# EAGLE design RS232 (EAGLE 4.16)
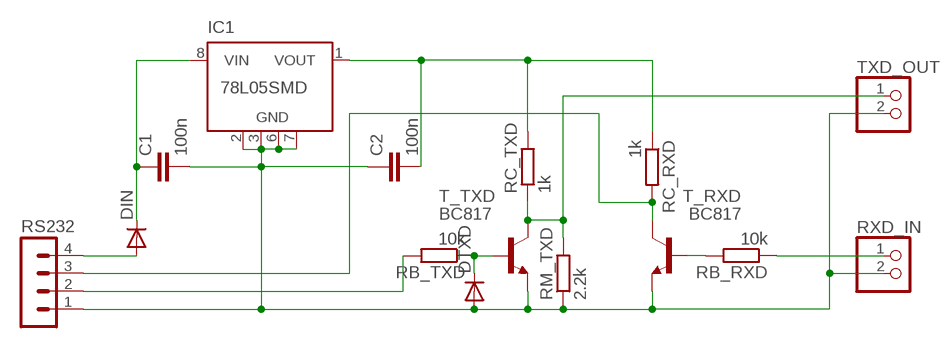
[diagram p0: schematic, sheet 1]

## Parts
C1  100n  C-EUC1206  [C1206]
C2  100n  C-EUC1206  [C1206]
DIN  DIODE-SMB  [SMB]
DTXD  DIODE-SMB  [SMB]
IC1  78L05SMD  [SO08]
RB_RXD  10k  R-EU_R1206  [R1206]
RB_TXD  10k  R-EU_R1206  [R1206]
RC_RXD  1k  R-EU_R1206  [R1206]
RC_TXD  1k  R-EU_R1206  [R1206]
RM_TXD  2.2k  R-EU_R1206  [R1206]
RS232  MA04-1  [MA04-1]
RXD_IN  PINHD-1X2  [1X02]
T_RXD  BC817  BC817-16SMD  [SOT23-BEC]
T_TXD  BC817  BC817-16SMD  [SOT23-BEC]
TXD_OUT  PINHD-1X2  [1X02]

## Nets
N$1: C1.1 DIN.C IC1.8(VIN)
N$2: C1.2 C2.1 DTXD.A IC1.2(GND) IC1.3(GND) IC1.6(GND) IC1.7(GND) RM_TXD.1 RS232.1 RXD_IN.2 T_RXD.E T_TXD.E TXD_OUT.2
N$3: DTXD.C RB_TXD.1 T_TXD.B
N$4: RB_RXD.2 T_RXD.B
N$5: RC_TXD.1 RM_TXD.2 T_TXD.C TXD_OUT.1
N$6: C2.2 IC1.1(VOUT) RC_RXD.1 RC_TXD.2
N$7: RB_RXD.1 RXD_IN.1
N$8: DIN.A RS232.4
N$9: RC_RXD.2 RS232.3 T_RXD.C
N$10: RB_TXD.2 RS232.2
Unconnected: IC1.4(NC) IC1.5(NC)

## Library data of the parts
C1 C2 = rcl:C-EU: CAPACITOR, European symbol
DIN DTXD = diode:DIODE-: DIODE
IC1 = linear:78L*SMD: Positive VOLTAGE REGULATOR
RB_RXD RB_TXD RC_RXD RC_TXD RM_TXD = rcl:R-EU_: RESISTOR, European symbol
RS232 = con-lstb:MA04-1: PIN HEADER
RXD_IN TXD_OUT = pinhead:PINHD-1X2: PIN HEADER
T_RXD T_TXD = transistor-npn:BC817*: NPN Transistor

## Board
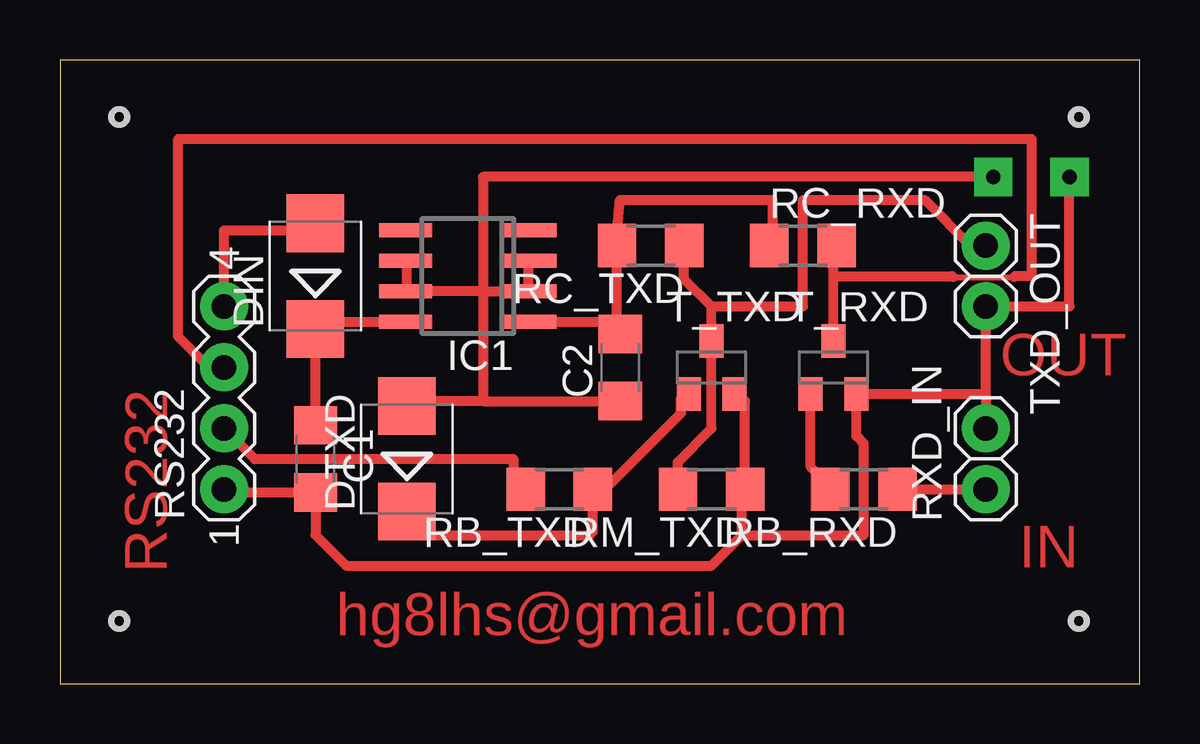
[diagram p1: board, top side]
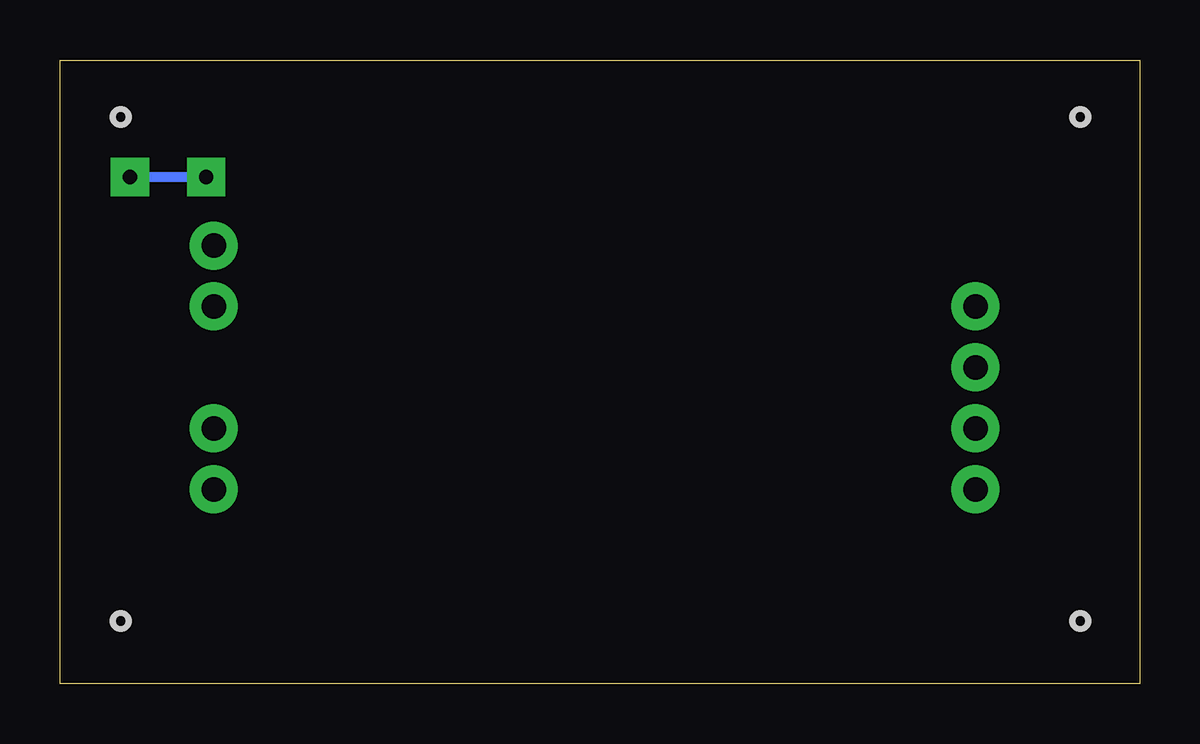
[diagram p2: board, bottom side, seen from below]

Size 45 x 26 mm. Coordinates in mm from the lower left corner, seen from the top.
Outline: 0,0 45,0 45,26 0,26 0,0
Copper layers (1*16): Top 0.0356mm / dielectric 1.5011mm / Bottom 0.0356mm
Design rules "default": minimum track width 0.1mm, minimum drill 1mil, track to track 0.25mm, track to pad 0.25mm, pad to pad 0.25mm, via to via 0.25mm, smd to smd 0.25mm, copper to edge 2.5mm, drill to drill 80mil, minimum pad ring 0.5mm, minimum via ring 0.5mm, stop-mask expansion 4mil, vias tented up to drill 0mil, thermal gap 10mil
Holes 0.5 mm at 2.47,23.63 2.47,2.63 42.47,2.63 42.47,23.63
Holes 0.6 mm at 2.47,23.63 2.47,2.63 42.47,2.63 42.47,23.63
Holes 0.7 mm at 2.47,23.63 2.47,2.63 42.47,2.63 42.47,23.63
Holes 0.8 mm at 2.47,23.63 2.47,2.63 42.47,2.63 42.47,23.63

### Footprints (pad centres in the part's own frame; a part is rotated, then mirrored left to right if it is on the bottom)
C1206 = smd 1.6 x 1.8: 1 -1.4,0; 2 1.4,0
SMB = smd 2.4 x 2.4: A 2.2,0; C -2.2,0
SO08 = smd 0.6 x 2.2: 1 -1.905,-2.6; 2 -0.635,-2.6; 3 0.635,-2.6; 4 1.905,-2.6; 5 1.905,2.6; 6 0.635,2.6; 7 -0.635,2.6; 8 -1.905,2.6
R1206 = smd 1.6 x 1.8: 1 -1.4,0; 2 1.4,0
MA04-1 = drill 1.016 long: 1 -3.81,0; 2 -1.27,0; 3 1.27,0; 4 3.81,0
1X02 = drill 1.016 long: 1 -1.27,0; 2 1.27,0
SOT23-BEC = smd 1 x 1.4: B -0.95,-1.1; C 0,1.1; E 0.95,-1.1

### Placement (x,y rotation side)
C1  10.65,9.38 270 top
C2  23.35,13.19 90 top
DIN  10.65,17 90 top
DTXD  14.46,9.38 90 top
IC1  17,17 90 top
RB_RXD  33.51,8.11 180 top
RB_TXD  20.81,8.11 180 top
RC_RXD  30.97,18.27 0 top
RC_TXD  24.62,18.27 180 top
RM_TXD  27.16,8.11 180 top
RS232  6.84,11.92 90 top
RXD_IN  38.59,9.38 90 top
T_RXD  32.24,13.19 0 top
T_TXD  27.16,13.19 0 top
TXD_OUT  38.59,17 270 top

### Tracks (layer width: path | path; a pad name or v marks a point on that pad's centre or on a via)
N$1
  Top 0.406: IC1.8 10.65,15.1 DIN.C C1.1 10.65,10.65
N$2  (via drill 0.6)
  Top 0.406: IC1.6 14.46,17.64 14.46,16.36 IC1.7 17.63,16.36 | IC1.3 19.54,17.64 19.54,16.36 IC1.2 17.63,16.36 | 14.46,11.92 DTXD.A 14.46,11.29 14.96,11.79 17.63,11.79 | 17.63,11.79 C2.1 17.77,11.79 17.63,11.92 | 17.63,11.92 17.63,11.79 | 38.59,11.92 RXD_IN.2 | 38.59,11.92 TXD_OUT.2 42.08,15.73 v42.08,21.13 | 38.59,11.92 38.42,12.09 T_RXD.E 33.19,10.33 33.51,10.01 33.51,6.2 28.43,6.2 | T_TXD.E 28.26,12.09 28.56,11.79 RM_TXD.1 28.43,8.11 28.43,6.2 | 28.43,6.2 27.16,4.93 11.92,4.93 10.65,6.2 C1.2 6.97,7.98 RS232.1 | 17.63,16.36 17.63,11.92 | 17.63,16.36 17.63,21.13 v38.91,21.13
  Bottom 0.406: v42.08,21.13 v38.91,21.13
N$3
  Top 0.406: DTXD.C 14.46,6.84 15.09,6.2 22.08,6.2 22.21,6.33 RB_TXD.1 22.71,8.11 25.89,11.29 25.89,11.92 26.06,12.09 T_TXD.B
N$4
  Top 0.406: RB_RXD.2 32.24,8.11 31.29,9.06 T_RXD.B
N$5
  Top 0.406: RC_TXD.1 26.02,16.87 27.16,15.73 | 27.16,15.73 T_TXD.C 27.16,10.65 25.76,9.25 RM_TXD.2 | TXD_OUT.1 37.95,18.27 36.05,20.18 30.97,20.18 30.97,15.73 27.16,15.73
N$6
  Top 0.406: C2.2 23.35,14.46 23.22,14.59 23.22,15.1 | 23.22,15.1 RC_TXD.2 23.22,18.78 23.35,20.18 29.7,20.18 29.7,18.27 RC_RXD.1 | 23.22,15.1 23.35,15.1 | IC1.1 23.22,15.1
N$7
  Top 0.406: RB_RXD.1 RXD_IN.1
N$8
  Top 0.406: RS232.4 6.84,18.9 10.65,18.9 DIN.A
N$9
  Top 0.254: 37.22,16.95 39.77,16.95
  Top 0.406: RC_RXD.2 32.24,18.27 32.24,17 | T_RXD.C 32.24,17 | RS232.3 6.2,13.19 4.94,14.46 4.94,22.71 40.5,22.71 40.5,17 39.81,17 39.77,16.95 | 32.24,17 37.18,17 37.22,16.95
N$10
  Top 0.406: RB_TXD.2 18.91,8.11 18.91,9.38 8.11,9.38 RS232.2

### Text on the board
Top: OUT | IN | RS232 | hg8lhs@gmail.com